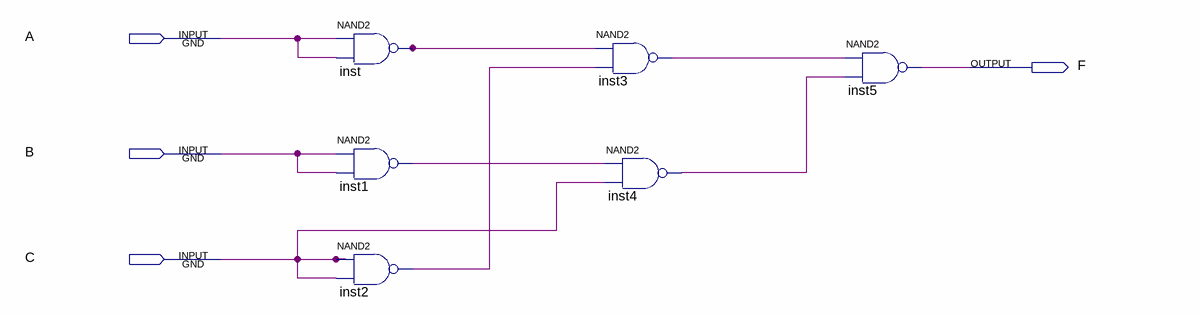
[diagram p0: schematic sheet]
// Quartus schematic gas1_1.bdf as structural Verilog: 6 symbols, 4 pins
module gas1_1 (
  input  A,
  input  B,
  input  C,
  output F
);

  wire inst1_out, inst2_out, inst3_out, inst4_out, inst_out;

  nand inst (inst_out, A, A);
  nand inst1 (inst1_out, B, B);
  nand inst2 (inst2_out, C, C);
  nand inst3 (inst3_out, inst_out, inst2_out);
  nand inst4 (inst4_out, inst1_out, C);
  nand inst5 (F, inst3_out, inst4_out);
endmodule
